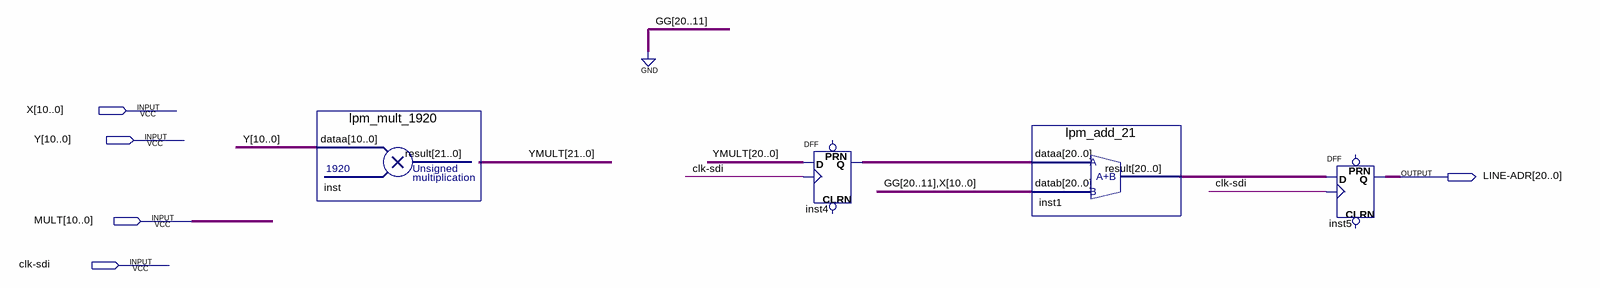
[diagram p0: schematic sheet]
// Quartus schematic LINE_ADR.bdf as structural Verilog: 4 symbols, 5 pins
module LINE_ADR (
  input  [10:0] X,
  input  [10:0] Y,
  input  [10:0] MULT,
  input  \clk-sdi ,
  output [20:0] \LINE-ADR 
);

  wire [20:0] inst1_result, inst4_q;
  wire [21:0] YMULT;

  lpm_mult_1920 inst (.dataa(Y), .result(YMULT));
  DFF inst4[20:0] (.CLK(\clk-sdi ), .D(YMULT[20:0]), .Q(inst4_q));  // open: CLRN, PRN
  lpm_add_21 inst1 (.dataa(inst4_q), .datab({{10{1'b0}}, X}), .result(inst1_result));
  DFF inst5[20:0] (.CLK(\clk-sdi ), .D(inst1_result), .Q(\LINE-ADR ));  // open: CLRN, PRN
endmodule
